# Altium schematic sheet 5_cyber60-smk_periferals.SchDoc: =ProjectTitle
size A4; Address1: github.com/4pplet/cyber60; Address2: Licence: CERN-OHL-S; SheetNumber: 5; SheetTotal: 5
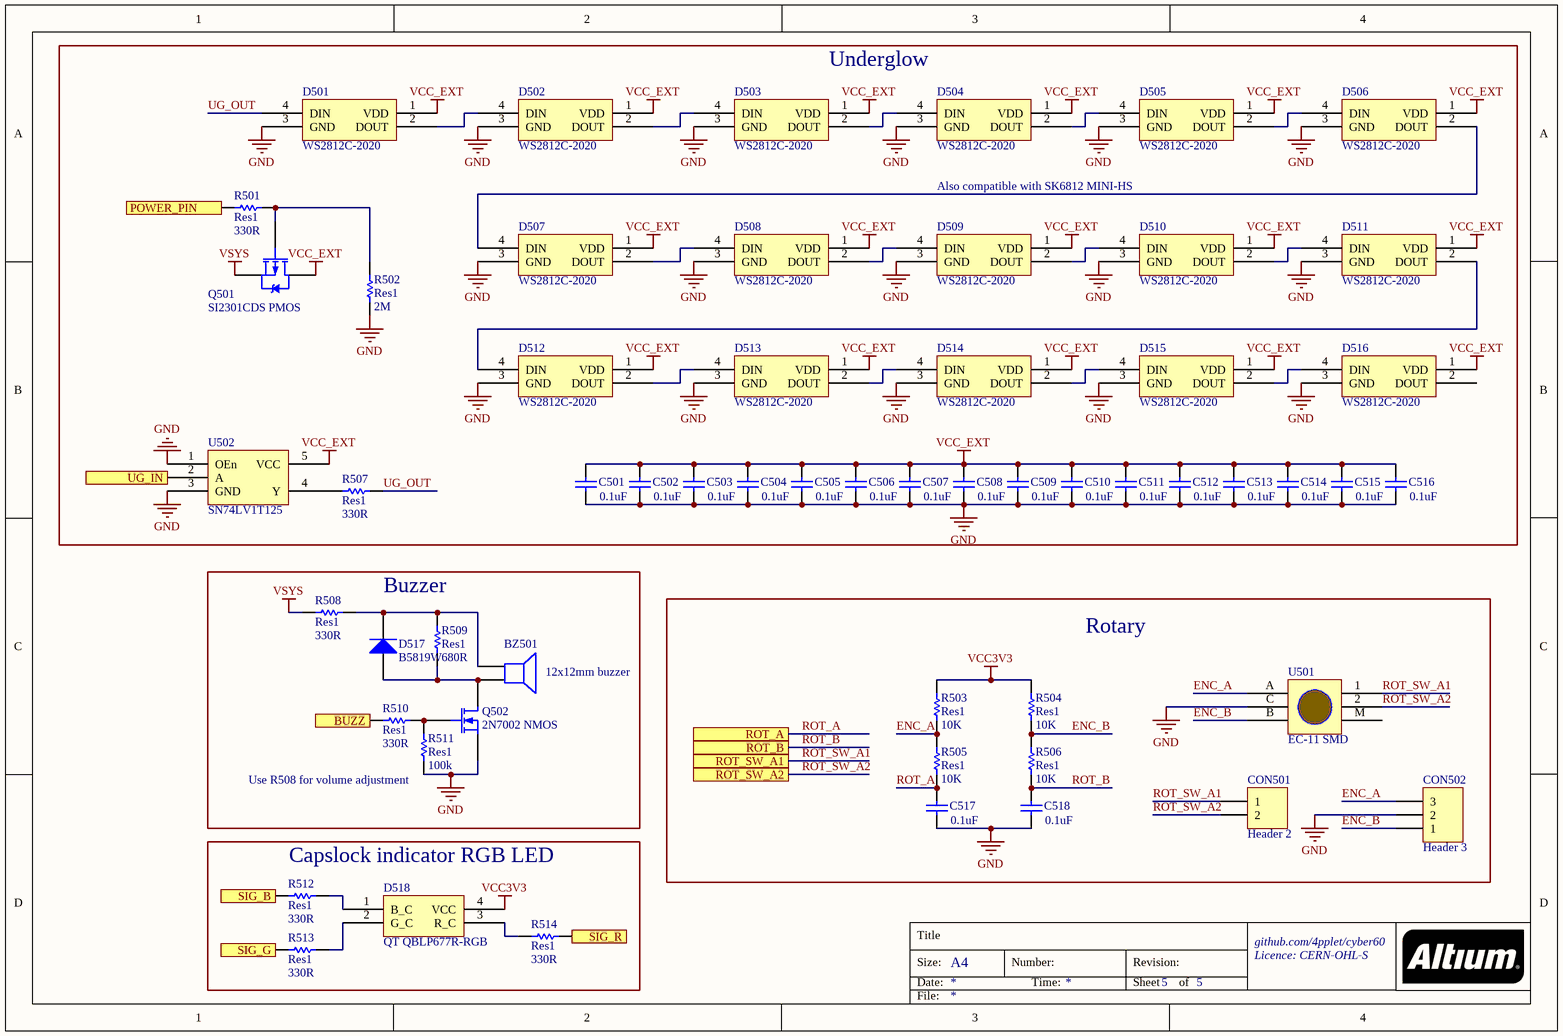
[diagram p0: 5_cyber60-smk_periferals.SchDoc]

## Parts
BZ501  12x12mm buzzer  [buzzer 12x12]
C501  value 0.1uF  [C0603[1608]]
C502  value 0.1uF  [C0603[1608]]
C503  value 0.1uF  [C0603[1608]]
C504  value 0.1uF  [C0603[1608]]
C505  value 0.1uF  [C0603[1608]]
C506  value 0.1uF  [C0603[1608]]
C507  value 0.1uF  [C0603[1608]]
C508  value 0.1uF  [C0603[1608]]
C509  value 0.1uF  [C0603[1608]]
C510  value 0.1uF  [C0603[1608]]
C511  value 0.1uF  [C0603[1608]]
C512  value 0.1uF  [C0603[1608]]
C513  value 0.1uF  [C0603[1608]]
C514  value 0.1uF  [C0603[1608]]
C515  value 0.1uF  [C0603[1608]]
C516  value 0.1uF  [C0603[1608]]
C517  value 0.1uF  [C0603[1608]]
C518  value 0.1uF  [C0603[1608]]
CON501  Header 2  [HDR1X2]  (no BOM)
CON502  Header 3  [HDR1X3]  (no BOM)
D501  WS2812C-2020  [WS2812B - 2020]
D502  WS2812C-2020  [WS2812B - 2020]
D503  WS2812C-2020  [WS2812B - 2020]
D504  WS2812C-2020  [WS2812B - 2020]
D505  WS2812C-2020  [WS2812B - 2020]
D506  WS2812C-2020  [WS2812B - 2020]
D507  WS2812C-2020  [WS2812B - 2020]
D508  WS2812C-2020  [WS2812B - 2020]
D509  WS2812C-2020  [WS2812B - 2020]
D510  WS2812C-2020  [WS2812B - 2020]
D511  WS2812C-2020  [WS2812B - 2020]
D512  WS2812C-2020  [WS2812B - 2020]
D513  WS2812C-2020  [WS2812B - 2020]
D514  WS2812C-2020  [WS2812B - 2020]
D515  WS2812C-2020  [WS2812B - 2020]
D516  WS2812C-2020  [WS2812B - 2020]
D517  B5819W  [SOD-123]
D518  QT QBLP677R-RGB  [QT QBLP677R-RGB]
Q501  SI2301CDS PMOS  [SOT-23-3]
Q502  2N7002 NMOS  [SOT-23-3]
R501  Res1  value 330R  [R0603[1608]]
R502  Res1  value 2M  [R0603[1608]]
R503  Res1  value 10K  [R0603[1608]]
R504  Res1  value 10K  [R0603[1608]]
R505  Res1  value 10K  [R0603[1608]]
R506  Res1  value 10K  [R0603[1608]]
R507  Res1  value 330R  [R0603[1608]]
R508  Res1  value 330R  [R0603[1608]]
R509  Res1  value 680R  [R0603[1608]]
R510  Res1  value 330R  [R0603[1608]]
R511  Res1  value 100k  [R0603[1608]]
R512  Res1  value 330R  [R0603[1608]]
R513  Res1  value 330R  [R0603[1608]]
R514  Res1  value 330R  [R0603[1608]]
U501  EC-11 SMD  [EC11-SMD]
U502  SN74LV1T125  [SOT-23-5]

## Blocks framed on the sheet
Underglow: C501-C516 D501-D516 Q501 R501 R502 R507 U502
Buzzer: BZ501 D517 Q502 R508-R511
Rotary: C517 C518 CON501 CON502 R503-R506 U501
Capslock indicator RGB LED: D518 R512-R514

## Ports
BUZZ, POWER_PIN, ROT_A, ROT_B, ROT_SW_A1, ROT_SW_A2, SIG_B, SIG_G, SIG_R, UG_IN

## Nets
GND: C501.1 C502.1 C503.1 C504.1 C505.1 C506.1 C507.1 C508.1 C509.1 C510.1 C511.1 C512.1 C513.1 C514.1 C515.1 C516.1 C517.1 C518.1 CON502.2 D501.3(GND) D502.3(GND) D503.3(GND) D504.3(GND) D505.3(GND) D506.3(GND) D507.3(GND) D508.3(GND) D509.3(GND) D510.3(GND) D511.3(GND) D512.3(GND) D513.3(GND) D514.3(GND) D515.3(GND) D516.3(GND) Q502.2(S) R502.1 R511.2 U501.C U502.1(OEn) U502.3(GND)
VCC3V3: D518.4(VCC) R503.1 R504.1
VCC_EXT: C501.2 C502.2 C503.2 C504.2 C505.2 C506.2 C507.2 C508.2 C509.2 C510.2 C511.2 C512.2 C513.2 C514.2 C515.2 C516.2 D501.1(VDD) D502.1(VDD) D503.1(VDD) D504.1(VDD) D505.1(VDD) D506.1(VDD) D507.1(VDD) D508.1(VDD) D509.1(VDD) D510.1(VDD) D511.1(VDD) D512.1(VDD) D513.1(VDD) D514.1(VDD) D515.1(VDD) D516.1(VDD) Q501.3(D) U502.5(VCC)
VSYS: Q501.2(S) R508.2
BUZZ: R510.2 ; port BUZZ
ENC_A: CON502.3 R503.2 R505.1 U501.A(B)
ENC_B: CON502.1 R504.2 R506.1 U501.B
POWER_PIN: R501.1 ; port POWER_PIN
ROT_A: C517.2 R505.2 ; port ROT_A
ROT_B: C518.2 R506.2 ; port ROT_B
ROT_SW_A1: CON501.1 U501.1 ; port ROT_SW_A1
ROT_SW_A2: CON501.2 U501.2 ; port ROT_SW_A2
SIG_B: R512.2 ; port SIG_B
SIG_G: R513.2 ; port SIG_G
SIG_R: R514.1 ; port SIG_R
UG_IN: U502.2(A) ; port UG_IN
UG_OUT: D501.4(DIN) R507.1
NetBZ501_1: BZ501.1 D517.2(K) R508.1 R509.1
NetBZ501_2: BZ501.2 D517.1(A) Q502.3(D) R509.2
NetD501_2: D501.2(DOUT) D502.4(DIN)
NetD502_2: D502.2(DOUT) D503.4(DIN)
NetD503_2: D503.2(DOUT) D504.4(DIN)
NetD504_2: D504.2(DOUT) D505.4(DIN)
NetD505_2: D505.2(DOUT) D506.4(DIN)
NetD506_2: D506.2(DOUT) D507.4(DIN)
NetD507_2: D507.2(DOUT) D508.4(DIN)
NetD508_2: D508.2(DOUT) D509.4(DIN)
NetD509_2: D509.2(DOUT) D510.4(DIN)
NetD510_2: D510.2(DOUT) D511.4(DIN)
NetD511_2: D511.2(DOUT) D512.4(DIN)
NetD512_2: D512.2(DOUT) D513.4(DIN)
NetD513_2: D513.2(DOUT) D514.4(DIN)
NetD514_2: D514.2(DOUT) D515.4(DIN)
NetD515_2: D515.2(DOUT) D516.4(DIN)
NetD518_1: D518.1(B_C) R512.1
NetD518_2: D518.2(G_C) R513.1
NetD518_3: D518.3(R_C) R514.2
NetQ501_1: Q501.1(G) R501.2 R502.2
NetQ502_1: Q502.1(G) R510.1 R511.1
NetR507_2: R507.2 U502.4(Y)

Not connected (* = marked no-connect by the designer): D516 2(DOUT); U501 M

## Notes on the sheet
- Also compatible with SK6812 MINI-HS
- (near R511) Use R508 for volume adjustment
- Title
- Size:
- Date:
- A4
- Number:
- Time:
- Revision:
- Sheet
- of
- File:

## Library data of the parts
BZ501 = Speaker: Loudspeaker; MRF.Part: YS-SBZ1230; LCSC MFG: Fengming; LCSC Part #: C409829
C501-C518 = Cap: Capacitor; MRF.Part: CC0603KRX7R9BB104; MFG: KEMET; MFGPN: C0603C104M5RACTU; LCSC MFG: YAGEO; Version: 0603 imperial; LCSC Part #: C14663
CON501 = Header 2: Header, 2-Pin
CON502 = Header 3: Header, 3-Pin
D501-D516 = WS2812B: LCSC MFG: Worldsemi; LCSC Part #: C965556; MRF.Part: WS2812C-2020
D517 = Diode: Default Diode; LCSC MFG: Changjiang Electronics Tech (CJ); Version: SOD-123; LCSC Part #: C8598; MRF.Part: B5819W
D518 = QT QBLP677R-RGB: RGB LED; MFG: QT Brightek (QTB); MFGPN: QBLP677R-RGB; Version: Common Anode RGB LED
Q501 = PMOS-2: P-Channel Power MOSFET; MRF.Part: SI2301CDS-T1-GE3; Note: Pin 4 not drawn and electrically connected to Pin 2.; LCSC MFG: Vishay Intertech; LCSC Part #: C10487
Q502 = MOSFET-N: N-Channel MOSFET; LCSC MFG: Changjiang Electronics Tech (CJ); LCSC Part #: C8545; MRF.Part: 2N7002
R501 R507 R508 R510 R512-R514 = Res1: Resistor; MRF.Part: 0603WAF3300T5E; LCSC MFG: Uniroyal Elec; Version: 0603 imperial; LCSC Part #: C23138
R502 = Res1: Resistor; MRF.Part: 0603WAF2004T5E; LCSC MFG: Uniroyal Elec; Version: 0603 imperial; LCSC Part #: C22976
R503-R506 = Res1: Resistor; MRF.Part: 0603WAF1002T5E; LCSC MFG: Uniroyal Elec; MFG: Panasonic Electronic Components; MFGPN: ERJ-3EKF5101V; Version: 0603 imperial; LCSC Part #: C25804
R509 = Res1: Resistor; MRF.Part: 0603WAF6800T5E; LCSC MFG: Uniroyal Elec; Version: 0603 imperial; LCSC Part #: C23228
R511 = Res1: Resistor; MRF.Part: 0603WAF1003T5E; LCSC MFG: Uniroyal Elec; Version: 0603 imperial; LCSC Part #: C25803
U501 = EC-11
U502 = SN74LV1T125: SN74LV1T125 or SN74LV1T34. Connect OE to GND; MRF.Part: SN74LV1T125DBVR; LCSC MFG: Texas Instruments; LCSC Part #: C473338; Version: SOT-23